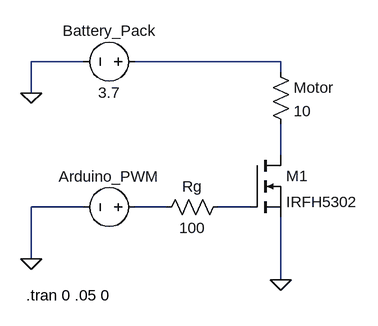
[diagram p0: schematic esc_circuit_v1.asc]
esc_circuit_v1.asc, the LTspice schematic file:
Version 4
SHEET 1 880 680
WIRE -80 -48 -160 -48
WIRE 224 -48 0 -48
WIRE 224 -32 224 -48
WIRE -160 0 -160 -48
WIRE 224 96 224 48
WIRE -80 176 -160 176
WIRE 48 176 0 176
WIRE 176 176 128 176
WIRE -160 256 -160 176
WIRE 224 288 224 192
FLAG -160 256 0
FLAG 224 288 0
FLAG -160 0 0
SYMBOL nmos 176 96 R0
SYMATTR InstName M1
SYMATTR Value IRFH5302
SYMBOL voltage 16 176 R90
WINDOW 0 -32 56 VBottom 2
WINDOW 3 32 56 Invisible 2
WINDOW 123 0 0 Left 2
WINDOW 39 0 0 Left 2
SYMATTR InstName Arduino_PWM
SYMATTR Value PULSE(0 5 0 0 0 1ms 2ms 10)
SYMBOL res 144 160 R90
WINDOW 0 0 56 VBottom 2
WINDOW 3 32 56 VTop 2
SYMATTR InstName Rg
SYMATTR Value 100
SYMBOL voltage 16 -48 M270
WINDOW 0 32 56 VTop 2
WINDOW 3 -32 56 VBottom 2
WINDOW 123 0 0 Left 2
WINDOW 39 0 0 Left 2
SYMATTR InstName Battery_Pack
SYMATTR Value 3.7
SYMBOL res 208 -48 R0
SYMATTR InstName Motor
SYMATTR Value 10
TEXT -168 312 Left 2 !.tran 0 .05 0

The netlist it stands for:
* esc_circuit_v1.asc
M1 N002 N004 0 0 IRFH5302
V§Arduino_PWM N003 0 PULSE(0 5 0 0 0 1ms 2ms 10)
Rg N004 N003 100
V§Battery_Pack N001 0 3.7
R§Motor N001 N002 10
.model NMOS NMOS
.model PMOS PMOS
.lib standard.mos
.tran 0 .05 0
.backanno
.end